# EAGLE design Placa_SecadorDeGraos_SL (EAGLE 9.2.0)
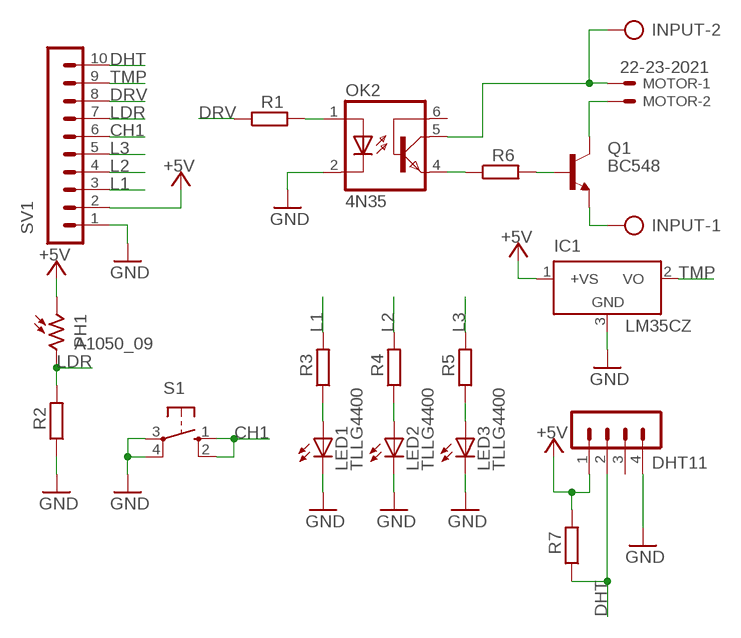
[diagram p0: schematic, sheet 1]

## Parts
DHT11  MA04-1  [MA04-1]
IC1  LM35CZ  [TO92]
INPUT  AK500/2  [AK500/2]
LED1  TLLG4400  [LED3MM]
LED2  TLLG4400  [LED3MM]
LED3  TLLG4400  [LED3MM]
MOTOR  22-23-2021  [22-23-2021]
OK2  4N35  [DIL06]
PH1  A1050_09  [T0-46-A10XX]
Q1  BC548  [TO92-EBC]
R1  R-EU_0204/7  [0204/7]
R2  R-EU_0204/7  [0204/7]
R3  R-EU_0204/7  [0204/7]
R4  R-EU_0204/7  [0204/7]
R5  R-EU_0204/7  [0204/7]
R6  R-EU_0204/7  [0204/7]
R7  R-EU_0204/7  [0204/7]
S1  10-XX  [B3F-10XX]
SV1  MA10-1  [MA10-1]

## Nets
+5V: DHT11.1 IC1.1(+VS) PH1.1 R7.2 SV1.2
CH1: S1.1(S) S1.2(S1) SV1.6
DHT: DHT11.2 R7.1 SV1.10
DRV: R1.1 SV1.8
GND: DHT11.4 IC1.3(GND) LED1.K(C) LED2.K(C) LED3.K(C) OK2.2(C) R2.1 S1.3(P) S1.4(P1) SV1.1
L1: R3.2 SV1.3
L2: R4.2 SV1.4
L3: R5.2 SV1.5
LDR: PH1.2 R2.2 SV1.7
N$1: LED1.A R3.1
N$2: LED2.A R4.1
N$3: LED3.A R5.1
N$4: MOTOR.2 Q1.C
N$5: OK2.1(A) R1.2
N$6: Q1.B R6.2
N$7: OK2.4(EMI) R6.1
N$8: INPUT.2 MOTOR.1 OK2.5(COL)
N$10: INPUT.1 Q1.E
TMP: IC1.2(VO) SV1.9
Unconnected: DHT11.3 OK2.6(BAS)

## Library data of the parts
DHT11 = con-lstb:MA04-1: PIN HEADER; OC_FARNELL: unknown; OC_NEWARK: unknown
IC1 = lm35:LM35: Single-Supply Centigrade Temperature Sensor Vout = (10mV/°C x Temp °C) +5mmmV Source: http://www.national.com/ds/LM/LM35.pdf
INPUT = con-ptr500:AK500/2: CONNECTOR; OC_FARNELL: unknown; OC_NEWARK: unknown
LED1-LED3 = led:TLLG4400: Low Current (2mA) LED 3 mm Tinted Diffused Package color GREEN Source: Data sheet <http://www.farnell.com/datasheets/391098.pdf>; MF: VISHAY SEMICONDUCTOR; OC_FARNELL: 1612435
MOTOR = con-molex:22-23-2021: .100" (2.54mm) Center Header - 2 Pin; MF: MOLEX; MPN: 22-23-2021; OC_FARNELL: 1462926; OC_NEWARK: 25C3832
OK2 = optocoupler:4N35: MOTOROLA OPTO COUPLER; MF: FAIRCHILD SEMICONDUCTOR; MPN: 4N35; OC_FARNELL: 1328375; OC_NEWARK: 72K9946
PH1 = photo-elements:A10: Sensor Robust Light Sensing Applications Outdoor Light Sensing Application Source: http://optoelectronics.perkinelmer.com/content/Datasheets/DTS_PhotocellsA1050.pdf
Q1 = transistor-npn:BC548*: NPN Transistor
R1-R7 = rcl:R-EU_: RESISTOR, European symbol; SPICEPREFIX: R
S1 = switch-omron:10-XX: OMRON SWITCH; MPN: B3F-1000; OC_FARNELL: 176432; OC_NEWARK: 36M3542
SV1 = con-lstb:MA10-1: PIN HEADER; OC_FARNELL: unknown; OC_NEWARK: unknown

## Board
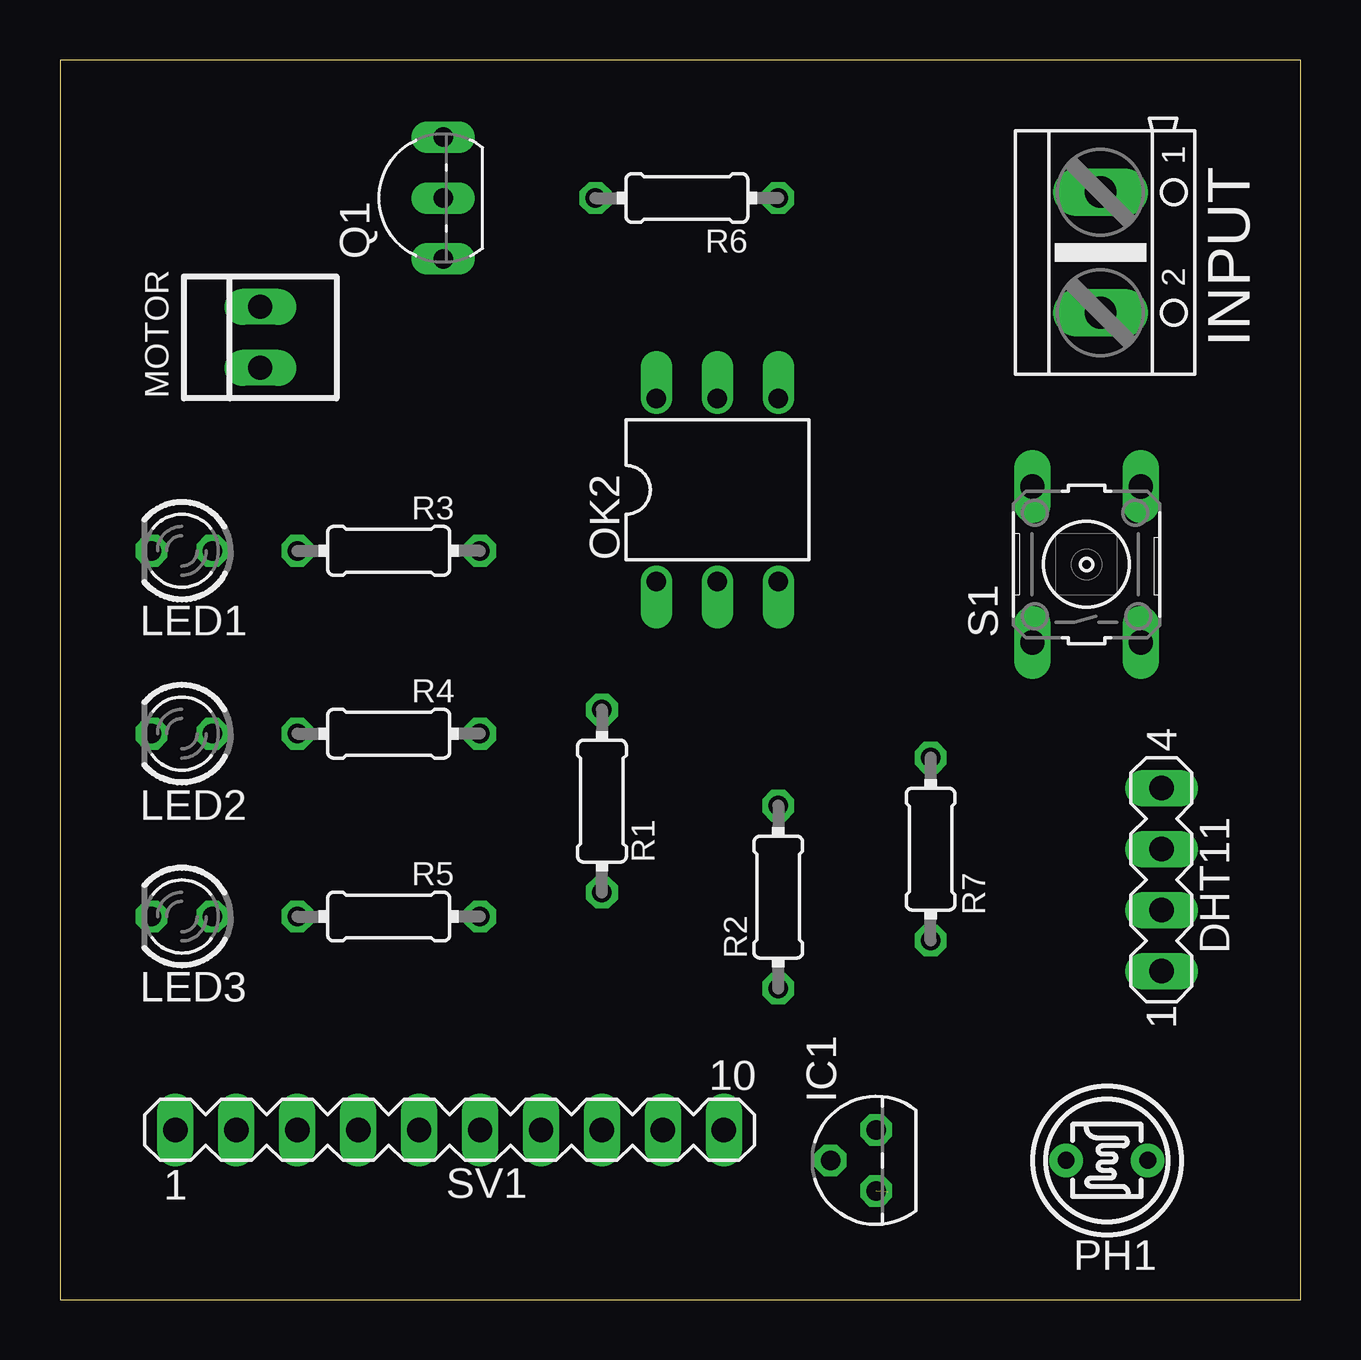
[diagram p1: board, top side]
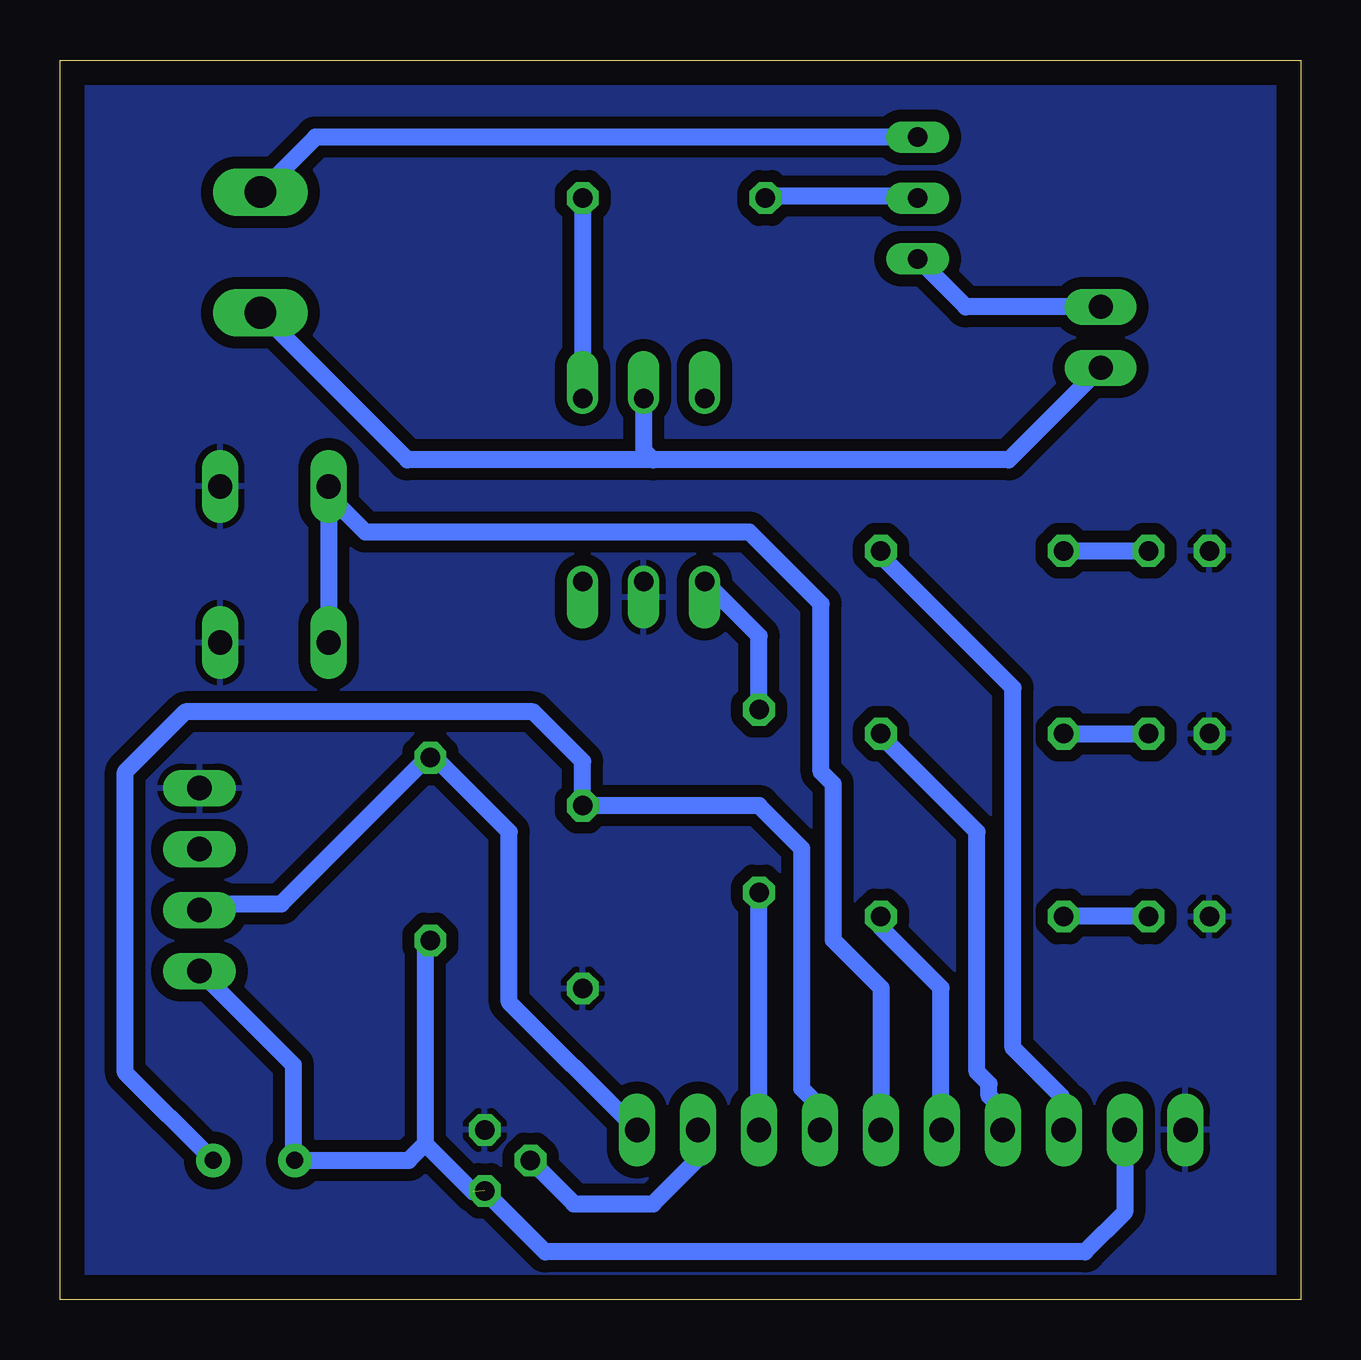
[diagram p2: board, bottom side, seen from below]

Size 51.73 x 51.66 mm. Coordinates in mm from the lower left corner, seen from the top.
Outline: 0,0 51.73,0 51.72,51.66 0,51.66 0,0
Copper layers (1*16): Top 0.035mm / dielectric 1.5mm / Bottom 0.035mm
Design rules "default *": minimum track width 0.7mm, minimum drill 0.7mm, track to track 0.5mm, track to pad 0.3mm, pad to pad 0.25mm, via to via 0.25mm, smd to smd 6mil, copper to edge 40mil, drill to drill 6mil, minimum pad ring 10mil, minimum via ring 8mil, stop-mask expansion 4mil, vias tented up to drill 0mil, thermal gap 10mil

### Footprints (pad centres in the part's own frame; a part is rotated, then mirrored left to right if it is on the bottom)
MA04-1 = drill 1.016 long: 1 -3.81,0; 2 -1.27,0; 3 1.27,0; 4 3.81,0
TO92 = drill 0.813 octagon: 1 -1.27,0; 2 0,1.905; 3 1.27,0
AK500/2 = drill 1.321 long: 1 -2.515,0; 2 2.515,0
LED3MM = drill 0.813 octagon: A -1.27,0; K 1.27,0
22-23-2021 = drill 1 long: 1 -1.27,0; 2 1.27,0
DIL06 = drill 0.813 offset: 1 -2.54,-3.81; 2 0,-3.81; 3 2.54,-3.81; 4 2.54,3.81; 5 0,3.81; 6 -2.54,3.81
T0-46-A10XX = drill 0.7 pad 1.4: 1 -1.7,0; 2 1.7,0
TO92-EBC = drill 0.813 long: B 0,-1.27; C -2.54,-1.27; E 2.54,-1.27
0204/7 = drill 0.813 octagon: 1 -3.81,0; 2 3.81,0
B3F-10XX = drill 1.016 long: 1 -3.251,2.261; 2 3.251,2.261; 3 -3.251,-2.261; 4 3.251,-2.261
MA10-1 = drill 1.016 long: 1 -11.43,0; 2 -8.89,0; 3 -6.35,0; 4 -3.81,0; 5 -1.27,0; 6 1.27,0; 7 3.81,0; 8 6.35,0; 9 8.89,0; 10 11.43,0

### Placement (x,y rotation side)
DHT11  45.91,17.51 90 top
IC1  34.02,5.81 90 top
INPUT  43.37,43.64 270 top
LED1  5.08,31.21 180 top
LED2  5.08,23.59 180 top
LED3  5.08,15.97 180 top
MOTOR  8.35,40.1 90 top
OK2  27.4,33.75 0 top
PH1  43.64,5.81 0 top
Q1  14.7,45.91 90 top
R1  22.59,20.78 90 top
R2  29.94,16.78 90 top
R3  13.7,31.21 0 top
R4  13.7,23.59 0 top
R5  13.7,15.97 0 top
R6  26.13,45.91 180 top
R7  36.29,18.78 270 top
S1  42.79,30.64 90 top
SV1  16.24,7.08 0 top

### Tracks (layer width: path | path; a pad name or v marks a point on that pad's centre or on a via)
+5V  (1 unrouted)
  Bottom 0.7: 36.5,6.5 34.5,4.5 | 36.5,6.5 36.5,14.5 R7.2 | IC1.1 34,4.5 31.5,2 9,2 7.35,3.65 SV1.2 | DHT11.1 42,9.79 42,5.87 PH1.1 37.19,5.81 36.5,6.5
CH1
  Bottom 0.7: SV1.6 17.5,7.5 17.5,13 19.5,15 19.5,21.5 20,22 20,29 23,32 39,32 40.53,33.53 S1.2 S1.1
DHT
  Bottom 0.7: DHT11.2 45.5,16.5 42.5,16.5 36.5,22.5 R7.1 36.09,22.59 33,19.5 33,12.41 SV1.10
DRV
  Bottom 0.7: SV1.8 R1.1
GND
  pour Bottom: 0,0 52.26,0 52.26,51.99 0,51.99
L1
  Bottom 0.7: R3.2 17.5,31 12,25.5 12,10.5 10,8.5 10,7.5 SV1.3
L2
  Bottom 0.7: R4.2 17.5,23.5 13.5,19.5 13.5,9.5 13,9 13,8.5 12.5,8 12.5,7.5 SV1.4
L3
  Bottom 0.7: R5.2 17.5,15.5 15,13 15,7.5 SV1.5
LDR
  Bottom 0.7: SV1.7 20.05,8.05 20.8,8.8 20.8,18.8 22.59,20.59 R2.2 29.94,22.44 32,24.5 46.5,24.5 49,22 49,9.47 PH1.2
N$1
  Bottom 0.7: R3.1 LED1.A
N$2
  Bottom 0.7: R4.1 LED2.A
N$3
  Bottom 0.7: LED3.A 6.5,16 9.5,16 R5.1
N$4
  Bottom 0.7: MOTOR.2 13.97,41.37 Q1.C
N$5
  Bottom 0.7: R1.2 22.59,27.67 OK2.1
N$6
  Bottom 0.7: Q1.B 16,46 22,46 R6.2
N$7
  Bottom 0.7: R6.1 OK2.4
N$8
  Bottom 0.7: MOTOR.1 12.18,35 27,35 | INPUT.2 37.24,35 27,35 | OK2.5 27.4,35.4 27,35
N$10
  Bottom 0.7: Q1.E 41.08,48.45 INPUT.1
TMP
  Bottom 0.7: IC1.2 30.3,4 27,4 25.13,5.87 SV1.9